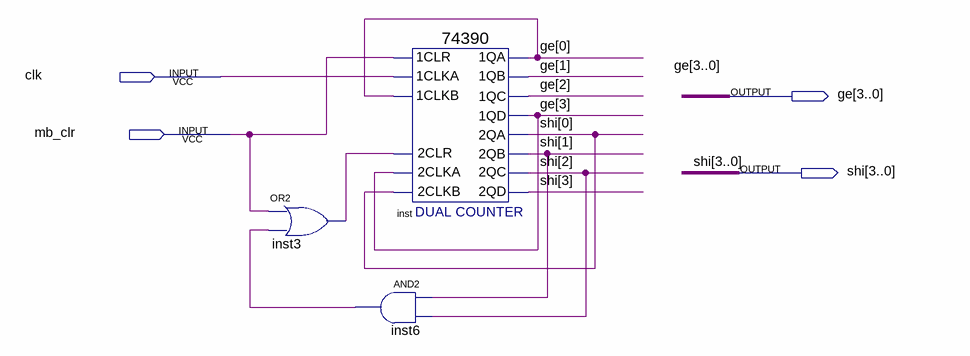
[diagram p0: schematic sheet]
// Quartus schematic mb_counter60.bdf as structural Verilog: 3 symbols, 4 pins
module mb_counter60 (
  input  clk,
  input  mb_clr,
  output [3:0] ge,
  output [3:0] shi
);

  wire inst3_out, inst6_out;

  or inst3 (inst3_out, mb_clr, inst6_out);
  \74390  inst (
    .\2CLKA (ge[3]), .\2CLR (inst3_out), .\2CLKB (shi[0]), .\1CLR (mb_clr), .\1CLKA (clk), .\1CLKB (ge[0]),
    .\1QA (ge[0]), .\1QB (ge[1]), .\1QC (ge[2]), .\1QD (ge[3]), .\2QA (shi[0]), .\2QB (shi[1]),
    .\2QC (shi[2]), .\2QD (shi[3]));
  and inst6 (inst6_out, shi[1], shi[2]);
endmodule
